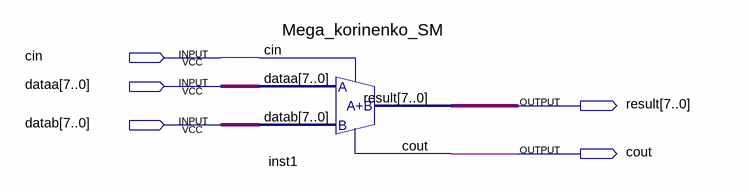
[diagram p0: schematic sheet]
// Quartus schematic sum8_korinenko.bdf as structural Verilog: 1 symbols, 5 pins
module sum8_korinenko (
  input  cin,
  input  [7:0] dataa,
  input  [7:0] datab,
  output [7:0] result,
  output cout
);

  Mega_korinenko_SM inst1 (.dataa(dataa), .datab(datab), .cin(cin), .result(result), .cout(cout));
endmodule
